# EAGLE design valentines-heart-punk-r1.2-rotated (EAGLE 5.12)
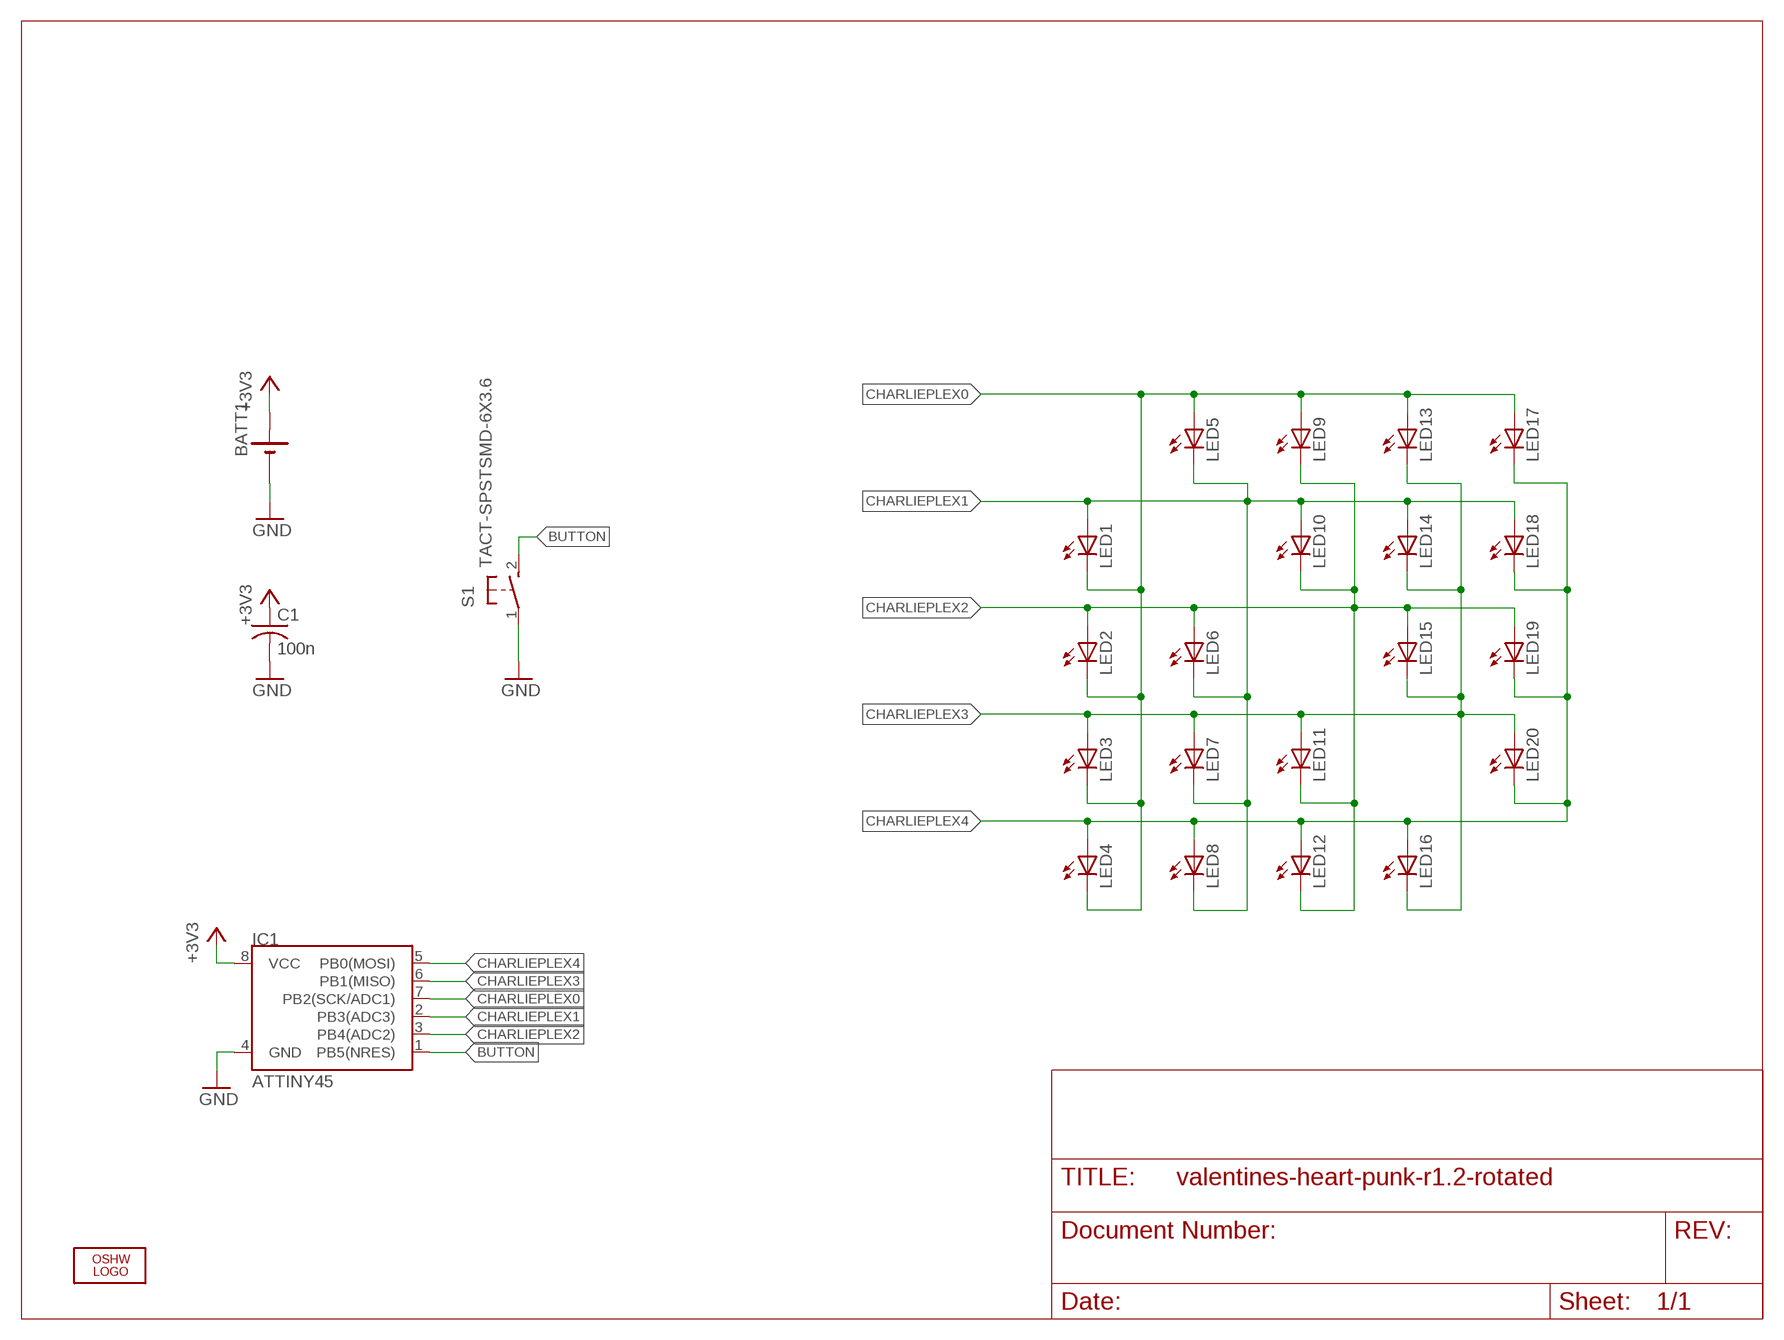
[diagram p0: schematic, sheet 1]

## Parts
BATT1  2032SMD  [2032SMD]
C1  100n  C-USC1206  [C1206]
IC1  ATTINY45  [SO08-EIAJ]
LED1  LEDCHIPLED_1206  [CHIPLED_1206]
LED2  LEDCHIPLED_1206  [CHIPLED_1206]
LED3  LEDCHIPLED_1206  [CHIPLED_1206]
LED4  LEDCHIPLED_1206  [CHIPLED_1206]
LED5  LEDCHIPLED_1206  [CHIPLED_1206]
LED6  LEDCHIPLED_1206  [CHIPLED_1206]
LED7  LEDCHIPLED_1206  [CHIPLED_1206]
LED8  LEDCHIPLED_1206  [CHIPLED_1206]
LED9  LEDCHIPLED_1206  [CHIPLED_1206]
LED10  LEDCHIPLED_1206  [CHIPLED_1206]
LED11  LEDCHIPLED_1206  [CHIPLED_1206]
LED12  LEDCHIPLED_1206  [CHIPLED_1206]
LED13  LEDCHIPLED_1206  [CHIPLED_1206]
LED14  LEDCHIPLED_1206  [CHIPLED_1206]
LED15  LEDCHIPLED_1206  [CHIPLED_1206]
LED16  LEDCHIPLED_1206  [CHIPLED_1206]
LED17  LEDCHIPLED_1206  [CHIPLED_1206]
LED18  LEDCHIPLED_1206  [CHIPLED_1206]
LED19  LEDCHIPLED_1206  [CHIPLED_1206]
LED20  LEDCHIPLED_1206  [CHIPLED_1206]
LOGO1  OSHW_LOGO_FILLX0100-NT  [OSHW_FILLX100_NOTEXT]
S1  TACT-SPSTSMD-6X3.6  [6X3.6-SPST]

## Nets
+3V3: BATT1.+ C1.1 IC1.8(VCC)
BUTTON: IC1.1(PB5(NRES)) S1.2(S)
CHARLIEPLEX0: IC1.7(PB2(SCK/ADC1)) LED1.C LED2.C LED3.C LED4.C LED5.A LED9.A LED13.A LED17.A
CHARLIEPLEX1: IC1.2(PB3(ADC3)) LED1.A LED5.C LED6.C LED7.C LED8.C LED10.A LED14.A LED18.A
CHARLIEPLEX2: IC1.3(PB4(ADC2)) LED2.A LED6.A LED9.C LED10.C LED11.C LED12.C LED15.A LED19.A
CHARLIEPLEX3: IC1.6(PB1(MISO)) LED3.A LED7.A LED11.A LED13.C LED14.C LED15.C LED16.C LED20.A
CHARLIEPLEX4: IC1.5(PB0(MOSI)) LED4.A LED8.A LED12.A LED16.A LED17.C LED18.C LED19.C LED20.C
GND: BATT1.- C1.2 IC1.4(GND) S1.1(P)

## Library data of the parts
BATT1 = rbg-4ucon-battery:2032SMD
C1 = rcl:C-US: CAPACITOR, American symbol
IC1 = SparkFun:ATTINY45: Atmel ATTiny45
LED1-LED20 = led:LED: LED OSRAM: - CHIPLED LG R971, LG N971, LY N971, LG Q971, LY Q971, LO R971, LY R971 LH N974, LH R974 LS Q976, LO Q976, LY Q976 LO Q996 - Hyper CHIPLED LW Q18S LB Q993, LB Q99A, LB R99A - SideLED LS A670, LO A670, LY A670, LG A670, LP A670 LB A673, LV A673, LT A673, LW A673 LH A674 LY A675 LS A676, LA A676, LO A676, LY A676, LW A676 LS A679, LY A679, LG A679 - Hyper Micro SIDELED® LS Y876, LA Y876, LO Y876, LY Y876 LT Y87S - SmartLED LW L88C, LW L88S LB L89C, LB L89S, LG L890 LS L89K, LO L89K, LY L89K LS L896, LA L896, LO L896, LY L896 - TOPLED LS T670, LO T670, LY T670, LG T670, LP T670 LSG T670, LSP T670, LSY T670, LOP T670, LYG T670 LG T671, LOG T671, LSG T671 LB T673, LV T673, LT T673, LW T673 LH T674 LS T676, LA T676, LO T676, LY T676, LB T676, LH T676, LSB T676, LW T676 LB T67C, LV T67C, LT T67C, LS T67K, LO T67K, LY T67K, LW E67C LS E67B, LA E67B, LO E67B, LY E67B, LB E67C, LV E67C, LT E67C LW T67C LS T679, LY T679, LG T679 LS T770, LO T770, LY T770, LG T770, LP T770 LB T773, LV T773, LT T773, LW T773 LH T774 LS E675, LA E675, LY E675, LS T675 LS T776, LA T776, LO T776, LY T776, LB T776 LHGB T686 LT T68C, LB T68C - Hyper Mini TOPLED® LB M676 - Mini TOPLED Santana® LG M470 LS M47K, LO M47K, LY M47K Source: http://www.osram.convergy.de LUXEON: - LUMILED® LXK2-PW12-R00, LXK2-PW12-S00, LXK2-PW14-U00, LXK2-PW14-V00 LXK2-PM12-R00, LXK2-PM12-S00, LXK2-PM14-U00 LXK2-PE12-Q00, LXK2-PE12-R00, LXK2-PE12-S00, LXK2-PE14-T00, LXK2-PE14-U00 LXK2-PB12-K00, LXK2-PB12-L00, LXK2-PB12-M00, LXK2-PB14-N00, LXK2-PB14-P00, LXK2-PB14-Q00 LXK2-PR12-L00, LXK2-PR12-M00, LXK2-PR14-Q00, LXK2-PR14-R00 LXK2-PD12-Q00, LXK2-PD12-R00, LXK2-PD12-S00 LXK2-PH12-R00, LXK2-PH12-S00 LXK2-PL12-P00, LXK2-PL12-Q00, LXK2-PL12-R00 Source: www.luxeon.com KINGBRIGHT: KA-3528ASYC Source: www.kingbright.com
LOGO1 = ohw-logo:OSHW_LOGO_FILL
S1 = rbg-generic-tact-switch:TACT-SPST

## Board
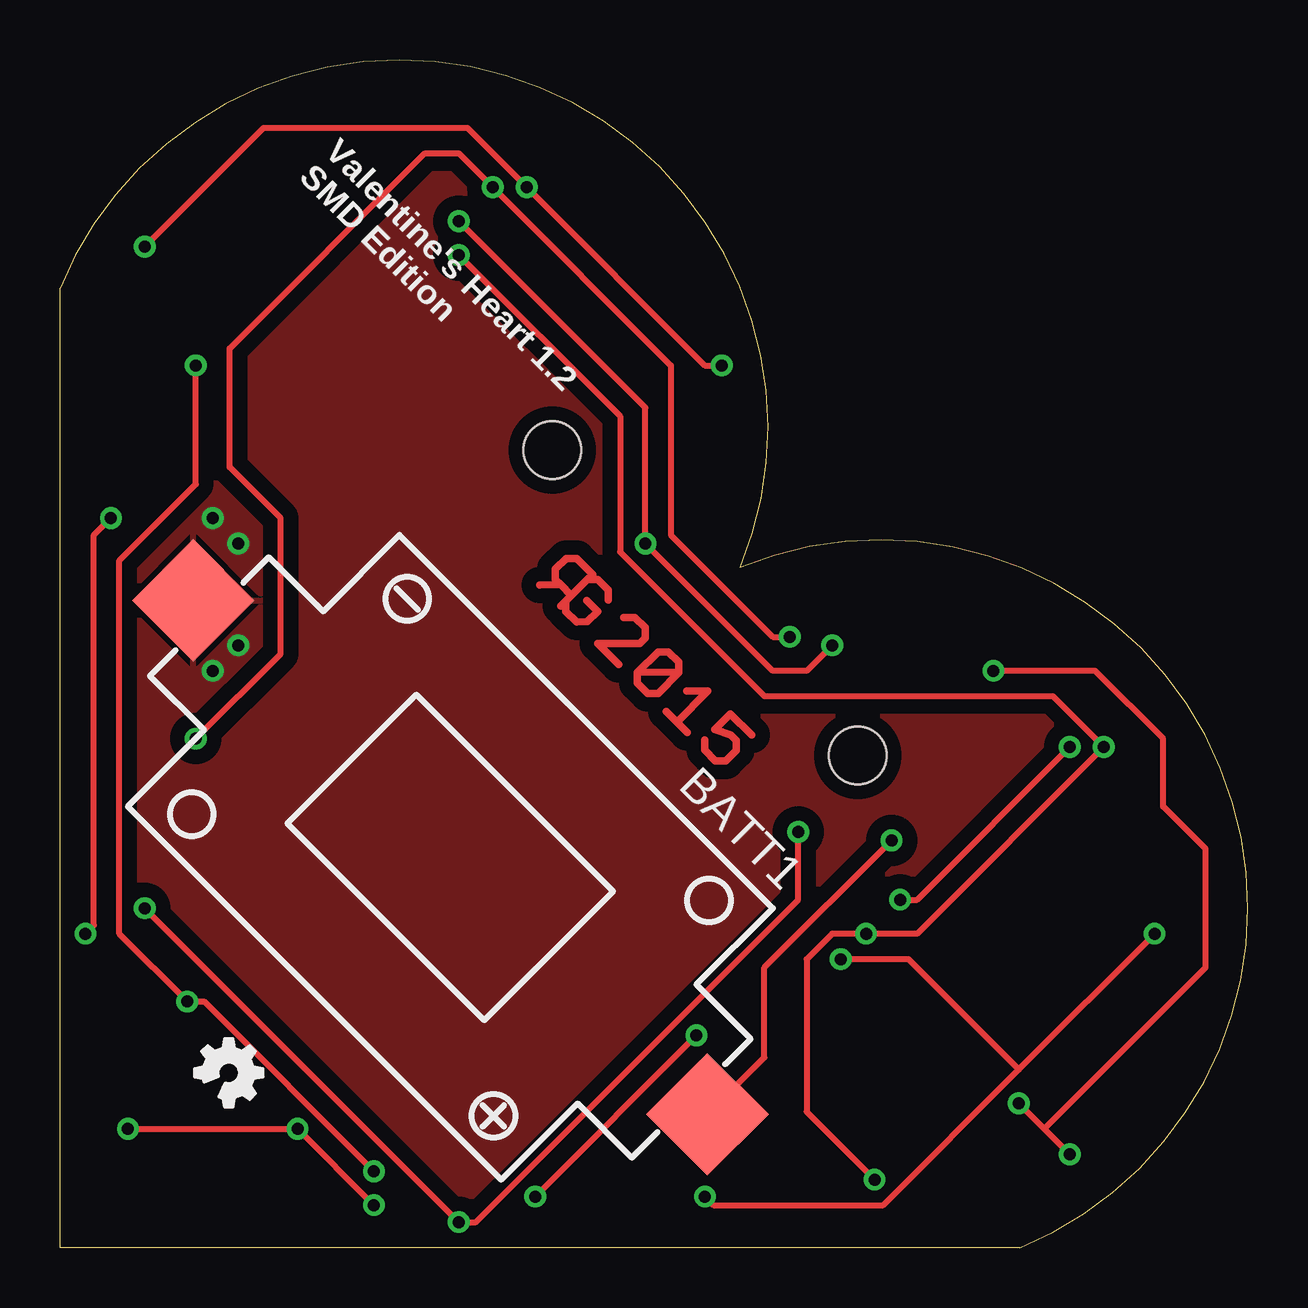
[diagram p1: board, top side]
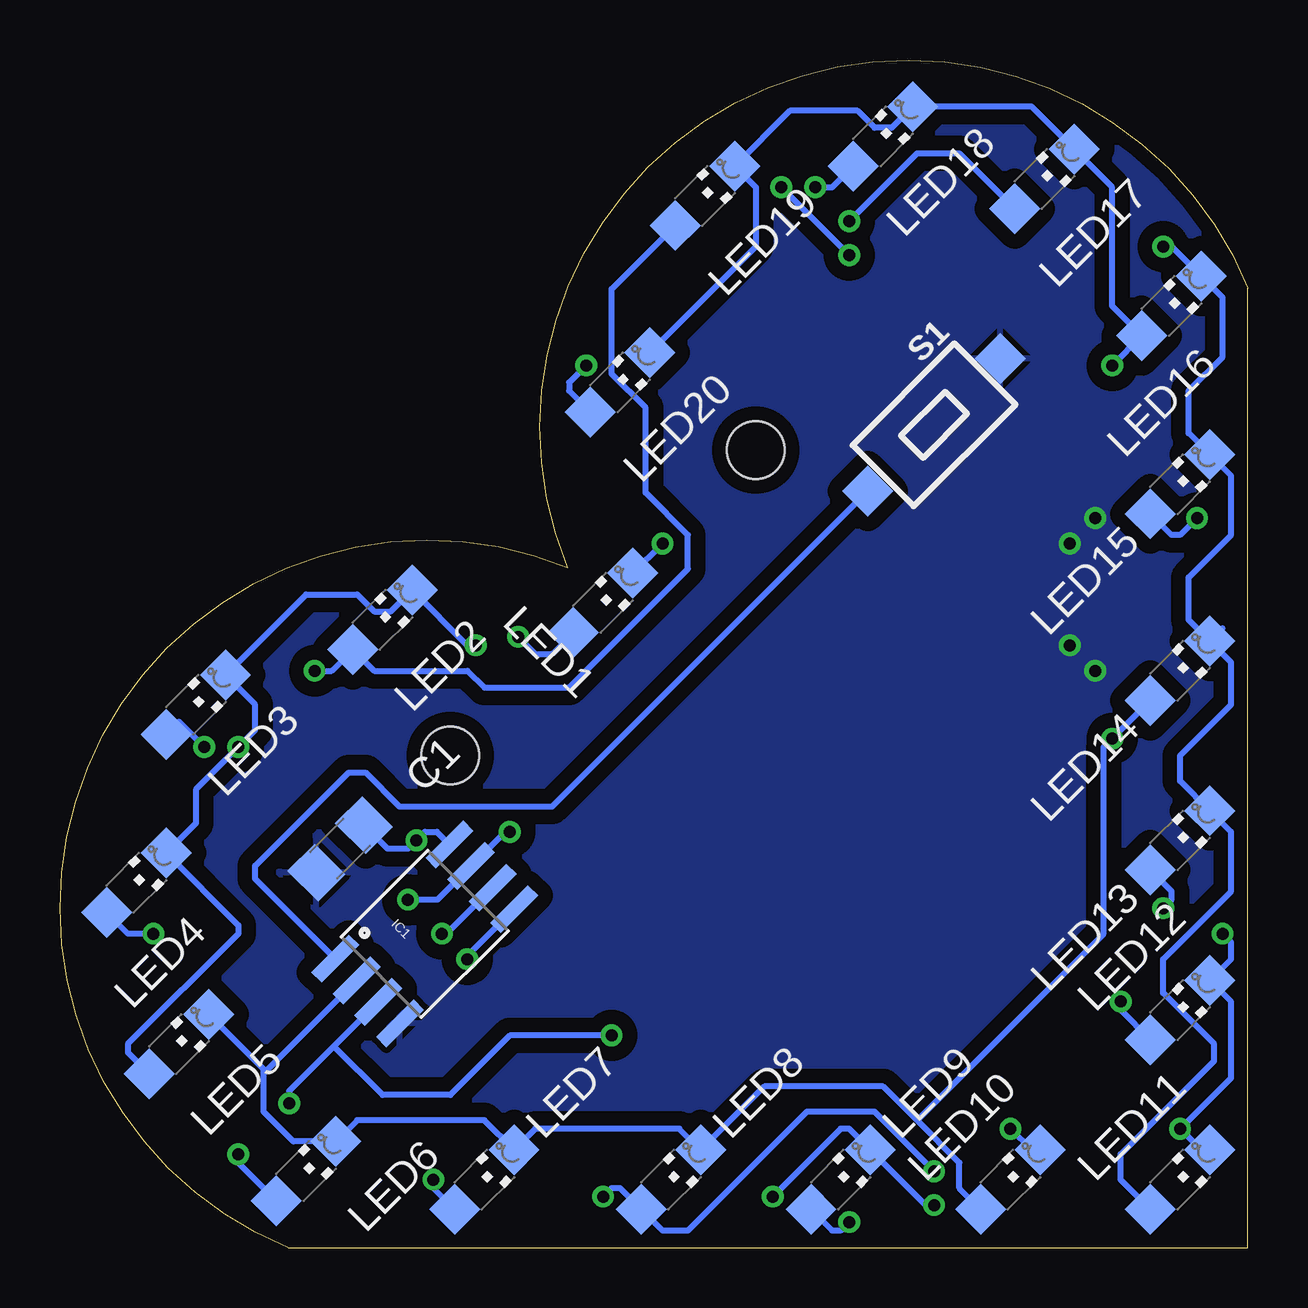
[diagram p2: board, bottom side, seen from below]

Size 49.5 x 49.5 mm. Coordinates in mm from the lower left corner, seen from the top.
Outline: 0,0 0,40 arc-180 28.35,28.35 arc-180 40,0 0,0
Copper layers (1*16): Top 0.035mm / dielectric 1.5mm / Bottom 0.035mm
Design rules "default *": minimum track width 10mil, minimum drill 0.5mm, track to track 10mil, track to pad 10mil, pad to pad 10mil, via to via 10mil, smd to smd 10mil, copper to edge 20mil, drill to drill 8mil, minimum pad ring 10mil, minimum via ring 8mil, stop-mask expansion 4mil, vias tented up to drill 20mil, thermal gap 10mil
Holes 2.4 mm at 33.23,20.51 20.51,33.23

### Footprints (pad centres in the part's own frame; a part is rotated, then mirrored left to right if it is on the bottom)
2032SMD = smd 3.6 x 3.6: + -15.15,0; - 15.15,0
C1206 = smd 1.6 x 1.8: 1 -1.4,0; 2 1.4,0
SO08-EIAJ = smd 0.61 x 2.21: 1 -1.905,-3.378; 2 -0.635,-3.378; 3 0.635,-3.378; 4 1.905,-3.378; 5 1.905,3.353; 6 0.635,3.353; 7 -0.635,3.353; 8 -1.905,3.353
CHIPLED_1206 = smd 1.5 x 1.5: A 0,-1.75; C 0,1.75
6X3.6-SPST = smd 1.5 x 1.5: 1 -3.9,0; 2 3.9,0

### Placement (x,y rotation side)
BATT1  16.26,16.26 135 top
C1  37.83,16.62 225 bottom
IC1  34.29,13.08 315 bottom
LED1  26.87,26.87 315 bottom
LED2  36.06,26.16 315 bottom
LED3  43.84,22.63 315 bottom
LED4  46.32,15.2 315 bottom
LED5  44.55,8.49 315 bottom
LED6  39.24,3.18 315 bottom
LED7  31.82,2.83 315 bottom
LED8  24.04,2.83 315 bottom
LED9  16.97,2.83 315 bottom
LED10  9.9,2.83 315 bottom
LED11  2.83,2.83 315 bottom
LED12  2.83,9.9 315 bottom
LED13  2.83,16.97 315 bottom
LED14  2.83,24.04 315 bottom
LED15  2.83,31.82 315 bottom
LED16  3.18,39.24 315 bottom
LED17  8.49,44.55 315 bottom
LED18  15.2,46.32 315 bottom
LED19  22.63,43.84 315 bottom
LED20  26.16,36.06 315 bottom
LOGO1  5.23,7.5 315 top
S1  13.08,34.29 225 bottom
U$1  [RGLOGO_SMALL_2015]  20.86,26.52 315 top

### Tracks (layer width: path | path; a pad name or v marks a point on that pad's centre or on a via)
+3V3  (via drill 0.5)
  Top 0.254: BATT1.+ 29.34,7.92 29.34,11.67 v34.65,16.97
  Bottom 0.254: C1.1 35.85,16.62 35,16.62 v34.65,16.97 34.3,17.32 33.8,17.32 IC1.8
BUTTON
  Bottom 0.254: S1.2 28.99,18.39 35.35,18.39 36.77,19.8 37.48,19.8 41.37,15.91 41.37,15.38 IC1.1
CHARLIEPLEX0  (via drill 0.5)
  Top 0.254: v3.54,14.14 v16.62,1.06 17.32,1.06 30.76,14.5 v30.76,17.32 | v16.62,42.78 24.39,35 v24.39,29.34 29.7,24.04 31.11,24.04 v32.17,25.1 | v35,14.5 35.71,14.5 v42.07,20.86
  Bottom 0.254: v16.62,42.78 13.79,45.61 12.02,45.61 LED17.A | LED9.A 17.32,0.71 16.97,0.71 v16.62,1.06 | LED5.A 46.67,8.13 46.67,8.48 42.07,13.08 42.07,13.44 LED4.C 43.84,17.68 43.84,19.09 v42.07,20.86 41.37,21.57 41.37,22.63 LED3.C 39.24,27.22 37.12,27.22 36.42,26.52 35.71,26.52 LED2.C 32.53,25.1 v32.17,25.1 | LED13.A 3.18,14.85 3.18,14.5 v3.54,14.14 | v30.76,17.32 30.95,17.32 IC1.7 33.78,14.5 v35,14.5 | v24.39,29.34 LED1.C
CHARLIEPLEX1  (via drill 0.5)
  Top 0.254: v5.66,21.21 9.19,24.75 9.19,30.41 7.07,32.53 7.07,37.48 15.2,45.61 16.62,45.61 v18.03,44.19 25.46,36.77 25.46,29.7 29.7,25.46 v30.41,25.46
  Bottom 0.254: 13.79,5.3 15.2,6.72 20.15,6.72 LED8.C 23.69,4.95 29.7,4.95 LED7.C 31.82,5.3 37.12,5.3 LED6.C 39.77,4.42 41.01,5.66 41.01,7.28 | 13.79,5.3 6.01,13.08 6.01,20.86 v5.66,21.21 LED14.A | 13.79,5.3 12.02,3.54 12.02,2.48 LED10.A | LED18.A 17.32,44.19 v18.03,44.19 | IC1.2 41,7.28 41.01,7.28 | LED5.C 41.01,7.42 41.01,7.28 | v30.41,25.46 29.7,24.75 28.99,24.75 LED1.A
CHARLIEPLEX2  (via drill 0.5)
  Top 0.254: 41.01,4.95 v42.07,3.89 | v39.95,6.01 41.01,4.95 | v13.08,1.77 v9.9,4.95 v2.83,4.95 | v2.12,30.41 1.41,29.7 1.41,13.44 v1.06,13.08 | v38.89,24.04 43.13,24.04 45.96,21.21 45.96,18.39 47.73,16.62 47.73,11.67 41.01,4.95 | v19.8,2.12 v26.52,8.84
  Bottom 0.254: v26.52,8.84 30.76,8.84 33.23,6.36 36.06,6.36 38.09,8.39 | v19.8,2.12 16.97,4.95 16.62,4.95 LED9.C 13.44,1.77 v13.08,1.77 | LED6.A 42.07,3.54 v42.07,3.89 | v38.89,24.04 38.18,24.04 LED2.A 36.42,24.04 32.53,24.04 31.82,23.33 28.28,23.33 23.33,28.28 23.33,29.7 25.1,31.47 25.1,35 26.52,36.42 26.52,39.95 LED19.A | v9.9,4.95 9.02,4.07 LED10.C | LED15.A 3.18,29.7 2.83,29.7 v2.12,30.41 | v1.06,13.08 0.71,12.73 0.71,12.02 LED12.C 0.71,10.25 0.71,7.07 v2.83,4.95 1.94,4.07 LED11.C | 38.09,8.39 IC1.3 | 38.09,8.39 39.95,6.53 v39.95,6.01
CHARLIEPLEX3  (via drill 0.5)
  Top 0.254: v33.94,2.83 31.11,5.66 31.11,12.02 32.17,13.08 v33.59,13.08 35.71,13.08 v43.49,20.86 41.37,22.98 29.34,22.98 23.33,28.99 23.33,34.65 v16.62,41.37 | v3.54,41.72 8.48,46.67 16.97,46.67 v19.45,44.19 26.87,36.77 v27.58,36.77
  Bottom 0.254: LED14.C 1.06,25.81 | v43.49,20.86 44.55,21.92 LED3.A | v19.45,44.19 v16.62,41.37 | LED7.A 33.94,2.48 v33.94,2.83 | v3.54,41.72 3.18,41.72 LED16.C 1.06,39.6 1.06,37.12 2.48,35.71 2.48,33.94 LED15.C 0.71,32.17 0.71,29.7 2.48,27.93 2.48,26.16 LED14.C | LED14.C 0.71,24.39 0.71,22.63 2.83,20.51 2.83,19.45 LED13.C 0.71,17.32 0.71,14.85 3.54,12.02 3.54,10.61 1.41,8.48 1.41,7.78 5.3,3.89 5.3,2.83 LED11.A | LED20.A 28.28,35.71 28.28,36.06 v27.58,36.77 | IC1.6 33.4,13.08 v33.59,13.08
CHARLIEPLEX4  (via drill 0.5)
  Top 0.254: v26.87,2.12 27.22,1.77 34.3,1.77 39.95,7.42 | 39.95,7.42 v45.61,13.08 | v5.66,36.77 5.66,31.82 2.48,28.64 2.48,13.08 v5.3,10.25 6.01,10.25 v13.08,3.18 | v32.53,12.02 35.35,12.02 39.95,7.42
  Bottom 0.254: v13.08,3.18 15.56,5.66 18.39,5.66 23.33,0.71 24.39,0.71 LED8.A 26.16,2.48 26.52,2.48 v26.87,2.12 | LED4.A 46.67,13.08 v45.61,13.08 | LED20.C 20.51,41.72 20.51,44.19 LED19.C 19.09,47.38 16.26,47.38 15.56,46.67 14.85,46.67 LED18.C 9.02,47.55 LED17.C 5.66,44.19 5.66,39.24 LED16.A v5.66,36.77 | LED12.A 5.3,9.9 v5.3,10.25 | IC1.5 32.53,12.15 v32.53,12.02
GND  (via drill 0.5)
  other vias: 6.36,30.41 7.42,29.34 7.42,25.1 6.36,24.04
  pour Top (isolate 0.61): 57.28,14.85 14.14,57.98 -25.1,18.74 18.03,-24.4
  pour Bottom (isolate 0.61): 57.28,14.85 14.14,57.98 -25.1,18.74 18.03,-24.4

### Text on the board
tNames: Valentine's Heart 1.2 | SMD Edition